# Altium schematic sheet Power 3.3V to mc.SchDoc
size A4; SheetNumber: 1; SheetTotal: 3
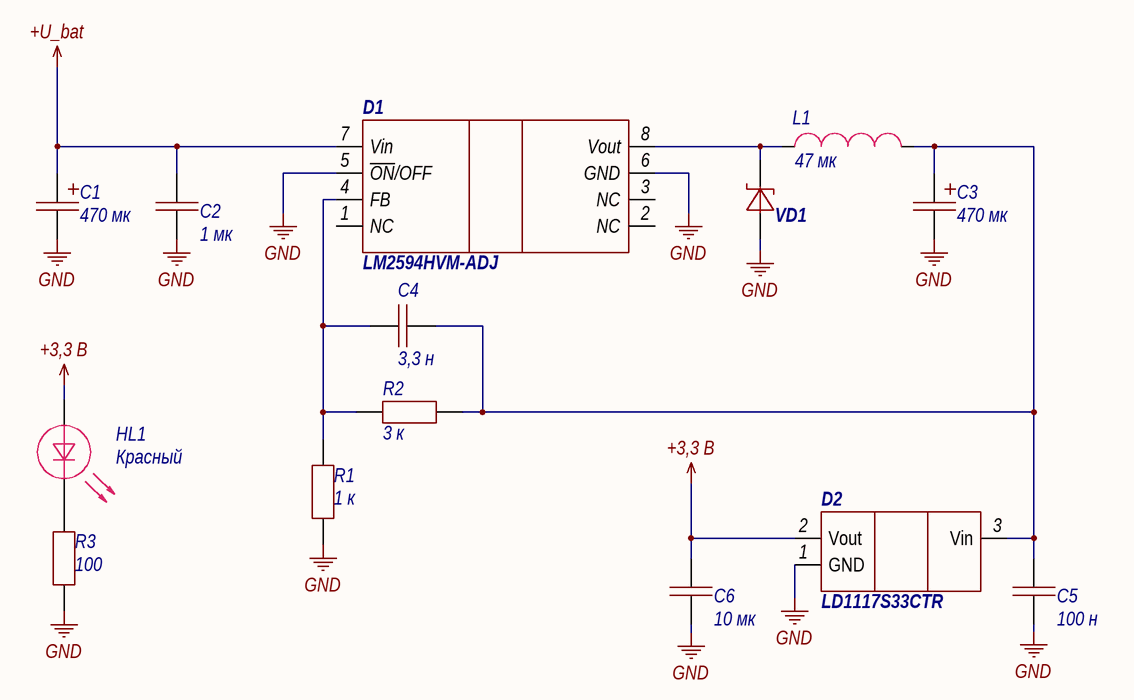
[diagram p0: Power 3.3V to mc.SchDoc]

## Parts
C1  value 470 мк  [RADIAL-2 8mm]  (hidden comment: Конденсатор полевой)
C2  value 1 мк  [0603C]  (hidden comment: Конденсатор)
C3  value 470 мк  [RADIAL-2 10MM]  (hidden comment: Конденсатор полевой)
C4  value 3,3 н  [0603C]  (hidden comment: Конденсатор)
C5  value 100 н  [0603C]  (hidden comment: Конденсатор)
C6  value 10 мк  [0603C]  (hidden comment: Конденсатор)
D1  LM2594HVM-ADJ  [SOIC_8N]
D2  LD1117S33CTR  [SOT223]
HL1  Color: Красный  [0805D]
L1  value 47 мк  [IND_B82477G]  (hidden comment: Inductance)
R1  value 1 к  [0603R]  (hidden comment: Resistor)
R2  value 3 к  [0603R]  (hidden comment: Resistor)
R3  value 100  [0603R]  (hidden comment: Resistor)
VD1  Диод Шоттки  [SMC]  (value not drawn)

## Nets
+3,3 В: C6.2 D2.2(Vout) HL1.1
+U_bat: C1.1 C2.2 D1.7(Vin)
GND: C1.2 C2.1 C3.2 C5.1 C6.1 D1.5(~{ON}/OFF) D1.6(GND) D2.1(GND) R1.2 R3.1 VD1.1
NetC3_1: C3.1 C4.2 C5.2 D2.3(Vin) L1.2 R2.2
NetC4_1: C4.1 D1.4(FB) R1.1 R2.1
NetD1_8: D1.8(Vout) L1.1 VD1.2
NetHL1_2: HL1.2 R3.2

Not connected (* = marked no-connect by the designer): D1 1(NC) 2(NC) 3(NC)

## Library data of the parts
C1 = Capacitor_pol: Конденсатор электролит. 470 мкФ, 50 В, 8 мм
C2 = Capacitor: Конденсатор керамический SMD, 0603, 1 мкФ
C3 = Capacitor_pol: Конденсатор электролит. 35В, 470мкФ, 10x16
C4 = Capacitor: Конденсатор керамический SMD, 0603
C5 = Capacitor: Конденсатор керамический SMD, 0603, 0.1 uF
C6 = Capacitor: Конденсатор керамический smd 10 мкФ, 0603,
D1 = LM2594HVM-ADJ: Импульсный DC-DC преобразователь, вход до 60 вольт, регулируемый выход, выходной ток 2 Ампера
D2 = LD1117S33CTR: Линейный стабилизатор напряжения 3,3 вольта. Максимальный ток - 0,8 ампер, гарантированное падение напряжения 1,3 вольта
HL1 = LED: Светодиод SMD 0805, 30 мА, 2.1 В; Manufacturer: -; Rate: -; Datasheet: -; Shop: -; Notice: -; Case: -
L1 = Inductance: Катушка индуктивности SMD, 47 мкГн, 2.5 А, 12.8х12.8, B82477G4473M,
R1 = Resistor: 0.1Вт 0603 1 кОм, 1%. Чип резистор (SMD); Power: *
R2 = Resistor: 0.1Вт 0603 1 кОм, 1%, Чип резистор (SMD); Power: *
R3 = Resistor: Резистор SMD, 43 Ом; Power: *
VD1 = Schottky diode: Диод Шоттки 30 В 3 А, SMD, SMC, SK33; Value: {Номинал}